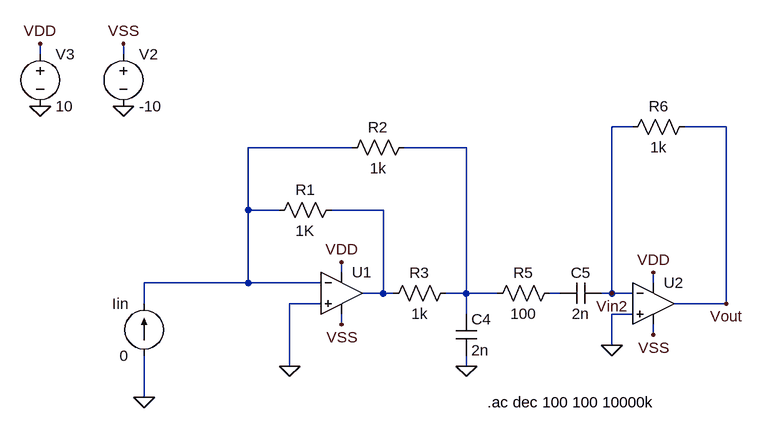
[diagram p0: schematic TIA-ALL_Z-BP4.asc]
TIA-ALL_Z-BP4.asc, the LTspice schematic file:
Version 4
SHEET 1 968 688
WIRE -128 -16 -128 -32
WIRE 0 -16 0 -32
WIRE 784 96 752 96
WIRE 928 96 864 96
WIRE 352 128 192 128
WIRE 528 128 432 128
WIRE 192 224 192 128
WIRE 240 224 192 224
WIRE 400 224 320 224
WIRE 336 320 336 304
WIRE 192 336 192 224
WIRE 192 336 32 336
WIRE 304 336 192 336
WIRE 816 336 816 320
WIRE 400 352 400 224
WIRE 400 352 368 352
WIRE 416 352 400 352
WIRE 528 352 528 128
WIRE 528 352 496 352
WIRE 576 352 528 352
WIRE 672 352 656 352
WIRE 752 352 752 96
WIRE 752 352 736 352
WIRE 784 352 752 352
WIRE 32 368 32 336
WIRE 304 368 256 368
WIRE 928 368 928 96
WIRE 928 368 848 368
WIRE 528 384 528 352
WIRE 784 384 752 384
WIRE 336 400 336 384
WIRE 816 416 816 400
WIRE 752 432 752 384
WIRE 256 464 256 368
WIRE 528 464 528 448
WIRE 32 512 32 448
FLAG 0 64 0
FLAG -128 64 0
FLAG -128 -32 VDD
FLAG 0 -32 VSS
FLAG 32 512 0
FLAG 256 464 0
FLAG 528 464 0
FLAG 752 432 0
FLAG 928 368 Vout
FLAG 752 352 Vin2
FLAG 816 320 VDD
FLAG 336 304 VDD
FLAG 336 400 VSS
FLAG 816 416 VSS
SYMBOL voltage 0 -32 R0
SYMATTR InstName V2
SYMATTR Value -10
SYMBOL voltage -128 -32 R0
SYMATTR InstName V3
SYMATTR Value 10
SYMBOL current 32 448 R180
WINDOW 0 24 80 Left 2
WINDOW 3 24 0 Left 2
SYMATTR InstName Iin
SYMATTR Value 0
SYMATTR Value2 AC 1
SYMBOL Res 336 208 R90
WINDOW 0 0 56 VBottom 2
WINDOW 3 32 56 VTop 2
SYMATTR InstName R1
SYMATTR Value 1K
SYMBOL Res 448 112 R90
WINDOW 0 0 56 VBottom 2
WINDOW 3 32 56 VTop 2
SYMATTR InstName R2
SYMATTR Value 1k
SYMBOL Res 512 336 R90
WINDOW 0 0 56 VBottom 2
WINDOW 3 32 56 VTop 2
SYMATTR InstName R3
SYMATTR Value 1k
SYMBOL Cap 512 384 R0
SYMATTR InstName C4
SYMATTR Value 2n
SYMBOL Res 672 336 R90
WINDOW 0 0 56 VBottom 2
WINDOW 3 32 56 VTop 2
SYMATTR InstName R5
SYMATTR Value 100
SYMBOL Cap 736 336 R90
WINDOW 0 0 32 VBottom 2
WINDOW 3 32 32 VTop 2
SYMATTR InstName C5
SYMATTR Value 2n
SYMBOL Res 880 80 R90
WINDOW 0 0 56 VBottom 2
WINDOW 3 32 56 VTop 2
SYMATTR InstName R6
SYMATTR Value 1k
SYMBOL UniversalOpAmp 336 352 R0
SYMATTR InstName U1
SYMBOL UniversalOpAmp 816 368 R0
SYMATTR InstName U2
TEXT 560 520 Left 2 !.ac dec 100 100 10000k

The netlist it stands for:
* TIA-ALL_Z-BP4.asc
V2 VSS 0 -10
V3 VDD 0 10
Iin 0 N001 0 AC 1
R1 N003 N001 1K
R2 N002 N001 1k
R3 N002 N003 1k
C4 N002 0 2n
R5 N004 N002 100
C5 Vin2 N004 2n
R6 Vout Vin2 1k
XU1 0 N001 VDD VSS N003 level1 Avol=1Meg GBW=10Meg Vos=0 En=0 Enk=0 In=0 Ink=0 Rin=500Meg  ; pins In+ In- V+ V- OUT
XU2 0 Vin2 VDD VSS Vout level1 Avol=1Meg GBW=10Meg Vos=0 En=0 Enk=0 In=0 Ink=0 Rin=500Meg  ; pins In+ In- V+ V- OUT
.ac dec 100 100 10000k
.lib UniversalOpAmp1.lib
.backanno
.end